# Altium schematic sheet N76E003_V3.5.SchDoc
size A3
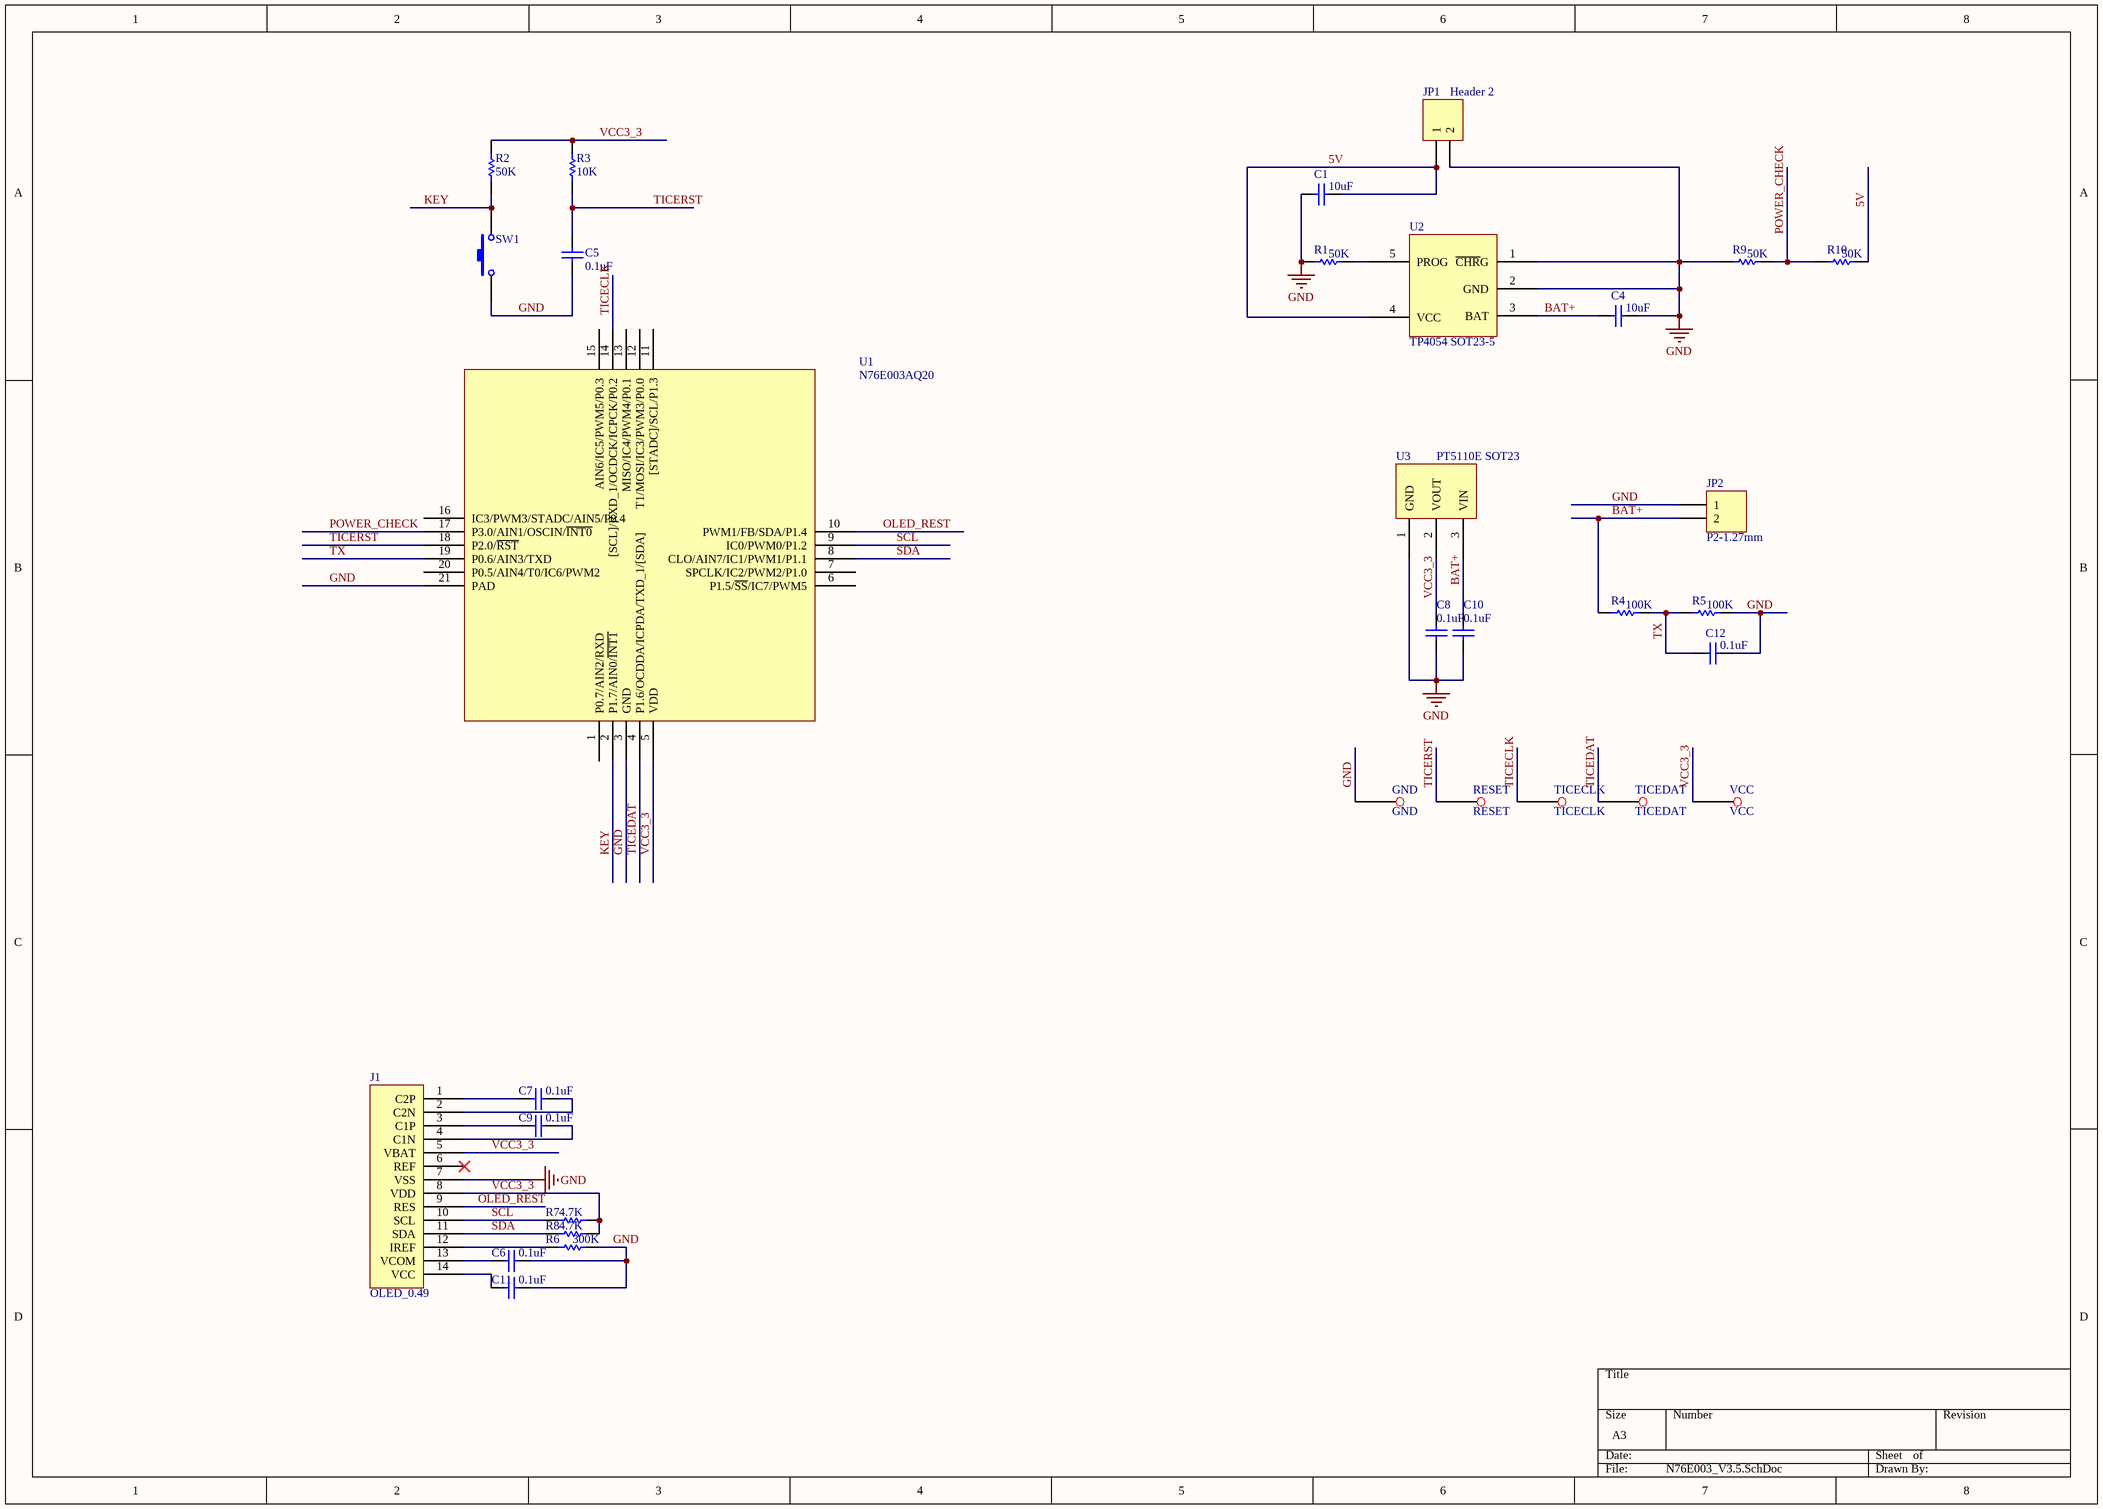
[diagram p0: N76E003_V3.5.SchDoc]

## Parts
C1  10uF  [C-0402]
C4  10uF  [C-0402]
C5  0.1uF  [C-0402]
C6  0.1uF  [C-0402]
C7  0.1uF  [C-0402]
C8  0.1uF  [C-0402]
C9  0.1uF  [C-0402]
C10  0.1uF  [C-0402]
C11  0.1uF  [C-0402]
C12  0.1uF  [C-0402]
GND  GND  [TP-1.3]
J1  OLED_0.49  [OLED-0.49]
JP1  Header 2  [HED 1X2 2.84MM]
JP2  P2-1.27mm  [HED1X2-1.27]
R1  50K  [R-0402]
R2  50K  [R-0402]
R3  10K  [R-0402]
R4  100K  [R-0402]
R5  100K  [R-0402]
R6  300K  [R-0402]
R7  4.7K  [R-0402]
R8  4.7K  [R-0402]
R9  50K  [R-0402]
R10  50K  [R-0402]
RESET  RESET  [TP-1.3]
SW1  SW-PB  [SWITCH]  (value not drawn)
TICECLK  TICECLK  [TP-1.3]
TICEDAT  TICEDAT  [TP-1.3]
U1  N76E003AQ20  [QFN-20 0.4mm]
U2  TP4054 SOT23-5  [SOT-23-5]
U3  PT5110E SOT23  [SOT-123]
VCC  VCC  [TP-1.3]

## Nets
GND: C1.1 C4.2 C5.1 C6.1 C8.1 C10.1 C11.1 C12.2 GND.?1 J1.7(VSS) JP1.2 JP2.1 R1.1 R5.2 R6.1 R9.1 SW1.1 U1.3(GND) U1.21(PAD) U2.1(~{CHR}G) U2.2(GND) U3.1(GND)
5V: C1.2 JP1.1 R10.2 U2.4(VCC)
BAT+: C4.1 C10.2 JP2.2 R4.1 U2.3(BAT) U3.3(VIN)
KEY: R2.1 SW1.2 U1.2(P1.7/AIN0/~{INT1})
OLED_REST: J1.9(RES) U1.10(PWM1/FB/SDA/P1.4)
POWER_CHECK: R9.2 R10.1 U1.17(P3.0/AIN1/OSCIN/~{INT0})
SCL: J1.10(SCL) R7.2 U1.9(IC0/PWM0/P1.2)
SDA: J1.11(SDA) R8.2 U1.8(CLO/AIN7/IC1/PWM1/P1.1)
TICECLK: TICECLK.?1 U1.14([SCL]/RXD_1/OCDCK/ICPCK/P0.2)
TICEDAT: TICEDAT.?1 U1.4(P1.6/OCDDA/ICPDA/TXD_1/[SDA])
TICERST: C5.2 R3.1 RESET.?1 U1.18(P2.0/~{RST})
TX: C12.1 R4.2 R5.1 U1.19(P0.6/AIN3/TXD)
VCC3_3: C8.2 J1.5(VBAT) J1.8(VDD) R2.2 R3.2 R7.1 R8.1 U1.5(VDD) U3.2(VOUT) VCC.?1
NetC6_2: C6.2 J1.13(VCOM)
NetC7_1: C7.1 J1.2(C2N)
NetC7_2: C7.2 J1.1(C2P)
NetC9_1: C9.1 J1.4(C1N)
NetC9_2: C9.2 J1.3(C1P)
NetC11_2: C11.2 J1.14(VCC)
NetJ1_12: J1.12(IREF) R6.2
NetR1_2: R1.2 U2.5(PROG)

Not connected (* = marked no-connect by the designer): J1 6(REF)*; U1 1(P0.7/AIN2/RXD) 6(P1.5/~{SS}/IC7/PWM5) 7(SPCLK/IC2/PWM2/P1.0) 11([STADC]/SCL/P1.3) 12(T1/MOSI/IC3/PWM3/P0.0) 13(MISO/IC4/PWM4/P0.1) 15(AIN6/IC5/PWM5/P0.3) 16(IC3/PWM3/STADC/AIN5/P0.4) 20(P0.5/AIN4/T0/IC6/PWM2)

## Library data of the parts
C1 C4-C12 = Cap: Capacitor; Published: 8-Jun-2000; LatestRevisionDate: 17-Jul-2002; LatestRevisionNote: Re-released for DXP Platform.; PackageReference: RAD-0.3; Publisher: Altium Limited
  C1 C4: Value: 10uF
  C5-C12: Value: 0.1uF
GND RESET TICECLK TICEDAT VCC = TP
JP1 JP2 = Header 2: Header, 2-Pin; LatestRevisionDate: 17-Jul-2002; LatestRevisionNote: Re-released for DXP Platform.; Publisher: Altium Limited
R1-R10 = Res1: Resistor; Published: 8-Jun-2000; LatestRevisionDate: 17-Jul-2002; LatestRevisionNote: Re-released for DXP Platform.; PackageReference: AXIAL-0.3; Publisher: Altium Limited
  R1 R2 R9 R10: Value: 50K
  R3: Value: 10K
  R4 R5: Value: 100K
  R6: Value: 300K
  R7 R8: Value: 4.7K
SW1 = SW-PB: Switch; Published: 24-Mar-1999; LatestRevisionDate: 17-Jul-2002; LatestRevisionNote: Re-released for DXP Platform.; PackageReference: SPST-2; Publisher: Altium Limited